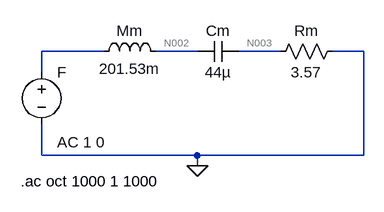
[diagram p0: schematic ex2_cone_falante.asc]
ex2_cone_falante.asc, the LTspice schematic file:
Version 4
SHEET 1 880 680
WIRE 32 80 -64 80
WIRE 176 80 112 80
WIRE 304 80 240 80
WIRE 432 80 384 80
WIRE -64 112 -64 80
WIRE -64 240 -64 192
WIRE 176 240 -64 240
WIRE 432 240 432 80
WIRE 432 240 176 240
WIRE 176 256 176 240
FLAG 176 256 0
SYMBOL voltage -64 96 R0
WINDOW 123 24 124 Left 2
WINDOW 39 0 0 Left 0
SYMATTR Value2 AC 1 0
SYMATTR InstName F
SYMATTR Value ""
SYMBOL ind 16 96 R270
WINDOW 0 32 56 VTop 2
WINDOW 3 5 56 VBottom 2
SYMATTR InstName Mm
SYMATTR Value 201.53m
SYMBOL cap 240 64 R90
WINDOW 0 0 32 VBottom 2
WINDOW 3 32 32 VTop 2
SYMATTR InstName Cm
SYMATTR Value 44µ
SYMBOL res 400 64 R90
WINDOW 0 0 56 VBottom 2
WINDOW 3 32 56 VTop 2
SYMATTR InstName Rm
SYMATTR Value 3.57
TEXT -96 280 Left 2 !.ac oct 1000 1 1000

The netlist it stands for:
* ex2_cone_falante.asc
V§F N001 0 AC 1 0
L§Mm N001 N002 201.53m
Cm N003 N002 44µ
Rm 0 N003 3.57
.ac oct 1000 1 1000
.backanno
.end

* Results of the author's LTspice run, read from the files saved beside the schematic
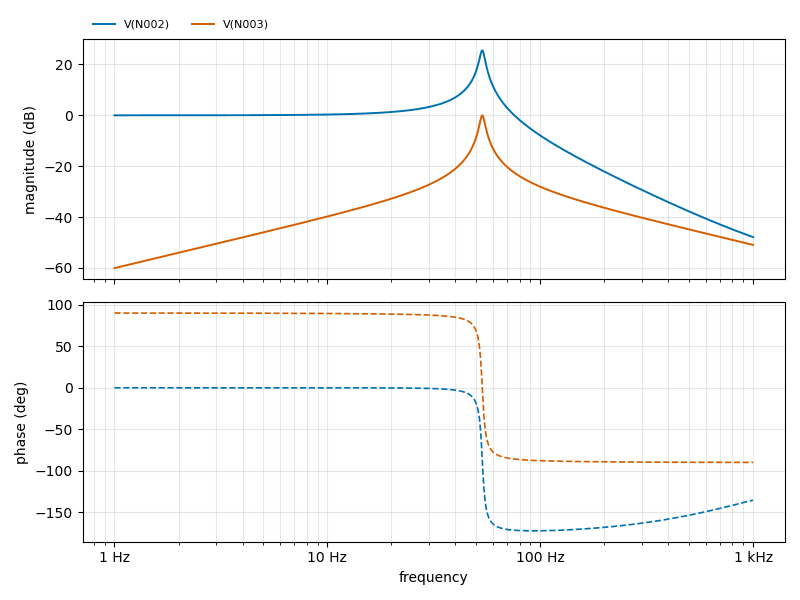
[diagram p1: AC Analysis of ex2_cone_falante.asc, plotted from the saved traces]
* AC Analysis, 1 run:
*   V(N002): 0.00 dB at 1 Hz, -47.90 dB at 1 kHz, peak 25.57 dB at 53.41 Hz, 3 dB below the peak at 51.98 Hz and 54.8 Hz
*   V(N003): -60.11 dB at 1 Hz, -50.97 dB at 1 kHz, peak -0.00 dB at 53.45 Hz, 3 dB below the peak at 52.06 Hz and 54.88 Hz